# EAGLE design guante_izquierdo (EAGLE 8.0.1)
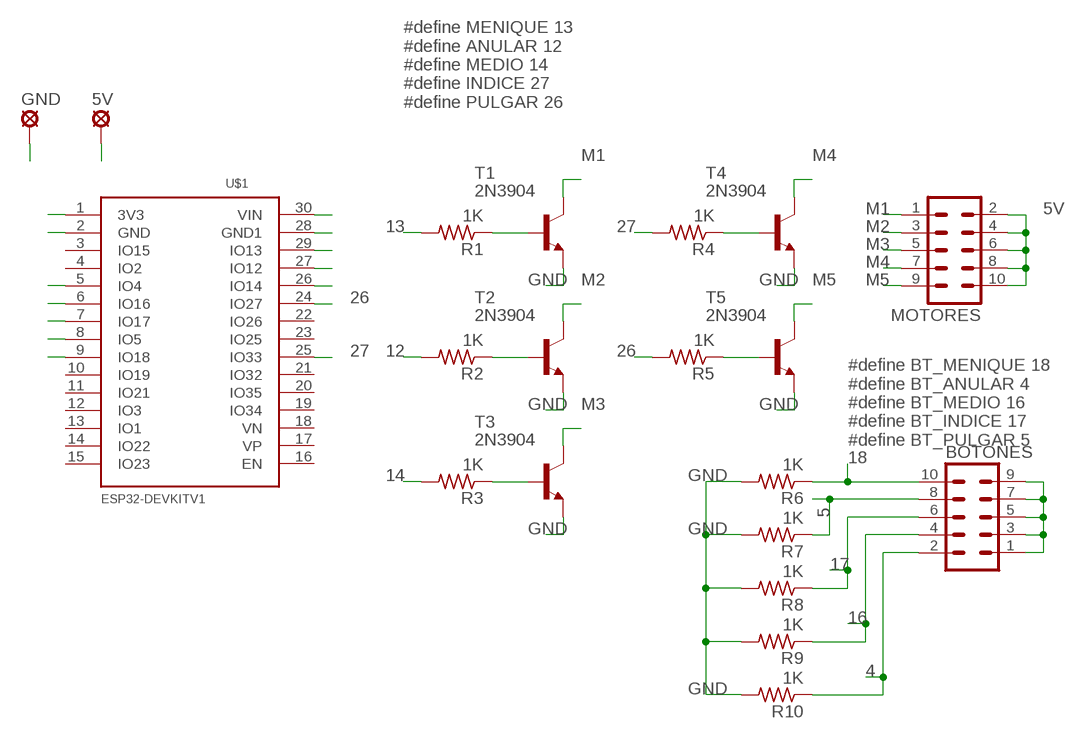
[diagram p0: schematic, sheet 1]

## Parts
5V  MCS10B  [MCS10B]
BOTONES  MA05-2  [MA05-2]
GND  MCS10B  [MCS10B]
MOTORES  MA05-2  [MA05-2]
R1  1K  R-US_0207/10  [0207/10]
R2  1K  R-US_0207/10  [0207/10]
R3  1K  R-US_0207/10  [0207/10]
R4  1K  R-US_0207/10  [0207/10]
R5  1K  R-US_0207/10  [0207/10]
R6  1K  R-US_0207/10  [0207/10]
R7  1K  R-US_0207/10  [0207/10]
R8  1K  R-US_0207/10  [0207/10]
R9  1K  R-US_0207/10  [0207/10]
R10  1K  R-US_0207/10  [0207/10]
T1  2N3904  -NPN-TO92-EBC  [TO92-EBC]
T2  2N3904  -NPN-TO92-EBC  [TO92-EBC]
T3  2N3904  -NPN-TO92-EBC  [TO92-EBC]
T4  2N3904  -NPN-TO92-EBC  [TO92-EBC]
T5  2N3904  -NPN-TO92-EBC  [TO92-EBC]
U$1  ESP32DEVKITV1  [ESP32-DEVKITV1]

## Nets
3V3: BOTONES.1 BOTONES.3 BOTONES.5 BOTONES.7 BOTONES.9 U$1.1(3V3)
4: BOTONES.2 R10.1 U$1.5(IO4)
5: BOTONES.8 R7.1 U$1.8(IO5)
5V: 5V.MP MOTORES.2 MOTORES.4 MOTORES.6 MOTORES.8 MOTORES.10 U$1.30(VIN)
12: R2.2 U$1.27(IO12)
13: R1.2 U$1.29(IO13)
14: R3.2 U$1.26(IO14)
16: BOTONES.4 R9.1 U$1.6(IO16)
17: BOTONES.6 R8.1 U$1.7(IO17)
18: BOTONES.10 R6.1 U$1.9(IO18)
26: R5.2 U$1.24(IO27)
27: R4.2 U$1.25(IO33)
GND: GND.MP R6.2 R7.2 R8.2 R9.2 R10.2 T1.E T2.E T3.E T4.E T5.E U$1.2(GND) U$1.28(GND1)
M1: MOTORES.1 T1.C
M2: MOTORES.3 T2.C
M3: MOTORES.5 T3.C
M4: MOTORES.7 T4.C
M5: MOTORES.9 T5.C
N$1: R2.1 T2.B
N$2: R1.1 T1.B
N$3: R3.1 T3.B
N$11: R4.1 T4.B
N$13: R5.1 T5.B
Unconnected: U$1.3(IO15) U$1.4(IO2) U$1.10(IO19) U$1.11(IO21) U$1.12(IO3) U$1.13(IO1) U$1.14(IO22) U$1.15(IO23) U$1.16(EN) U$1.17(VP) U$1.18(VN) U$1.19(IO34) U$1.20(IO35) U$1.21(IO32) U$1.22(IO26) U$1.23(IO25)

## Notes on the sheet
- #define MENIQUE 13
  #define ANULAR 12
  #define MEDIO 14
  #define INDICE 27
  #define PULGAR 26
- #define BT_MENIQUE 18
  #define BT_ANULAR 4
  #define BT_MEDIO 16
  #define BT_INDICE 17
  #define BT_PULGAR 5

## Library data of the parts
5V GND = solpad:MCS10B: SOLDER PAD MC S1, distributor Buerklin, 15F505
BOTONES MOTORES = con-lstb:MA05-2: PIN HEADER; OC_FARNELL: unknown; OC_NEWARK: unknown
R1-R10 = rcl:R-US_: RESISTOR, American symbol
T1-T5 = transistor:*-NPN-: NPN Transistror BF959 corrected 2008.03.06
U$1 = ESP32-DEVKITV1:ESP32DEVKITV1

## Board
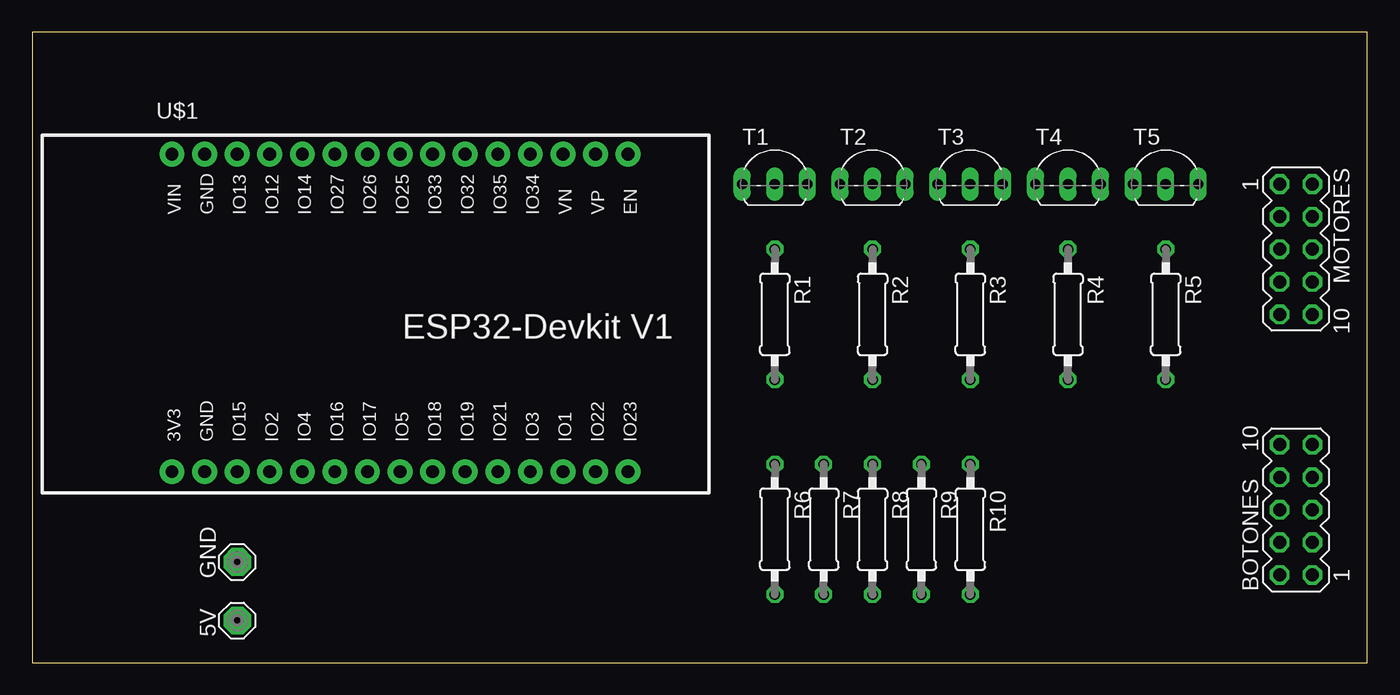
[diagram p1: board, top side]
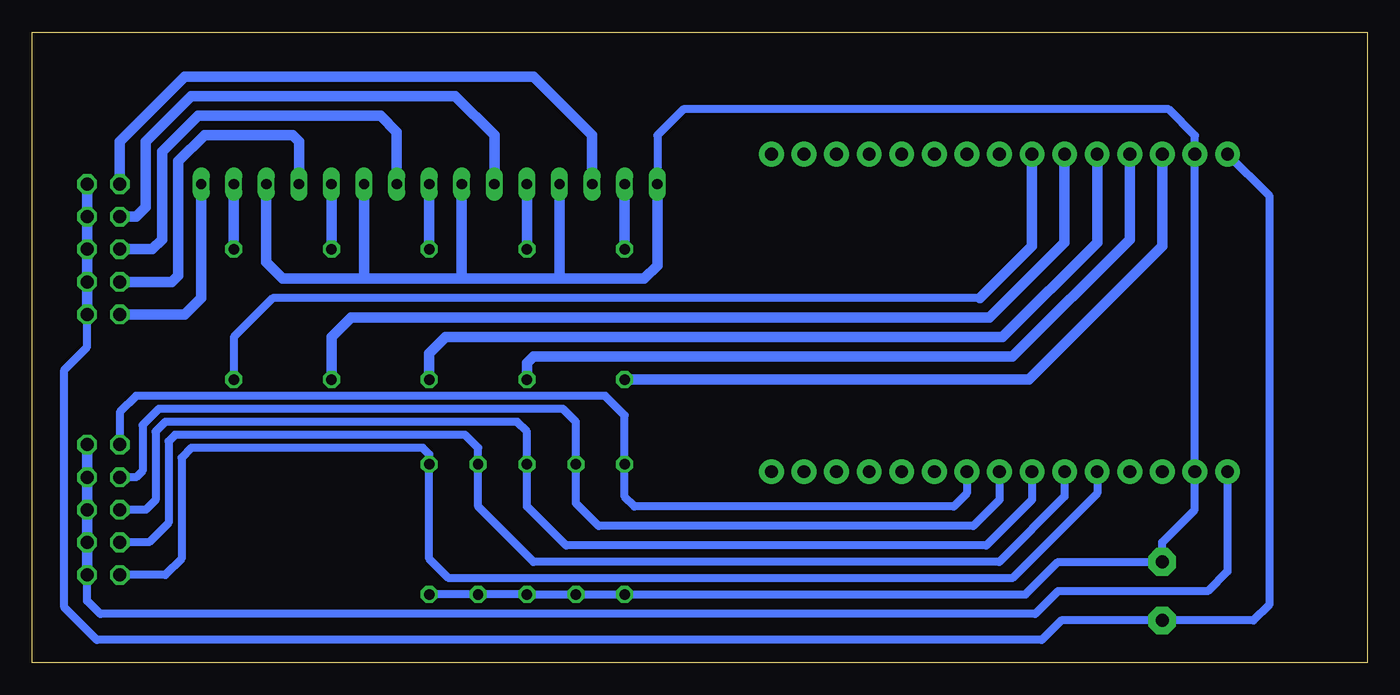
[diagram p2: board, bottom side, seen from below]

Size 104.12 x 49.2 mm. Coordinates in mm from the lower left corner, seen from the top.
Outline: 0,0 104.12,0 104.12,49.2 0,49.2 0,0
Copper layers (1*16): Top 0.035mm / dielectric 1.5mm / Bottom 0.035mm
Design rules "default": minimum track width 10mil, minimum drill 24mil, track to track 8mil, track to pad 8mil, pad to pad 8mil, via to via 8mil, smd to smd 8mil, copper to edge 40mil, drill to drill 8mil, minimum pad ring 10mil, minimum via ring 8mil, stop-mask expansion 4mil, vias tented up to drill 0mil, thermal gap 10mil

### Footprints (pad centres in the part's own frame; a part is rotated, then mirrored left to right if it is on the bottom)
MCS10B = drill 1.016 pad 2.159 octagon: MP 0,0
MA05-2 = drill 1.016 octagon: 1 -5.08,-1.27; 2 -5.08,1.27; 3 -2.54,-1.27; 4 -2.54,1.27; 5 0,-1.27; 6 0,1.27; 7 2.54,-1.27; 8 2.54,1.27; 9 5.08,-1.27; 10 5.08,1.27
0207/10 = drill 0.813 octagon: 1 -5.08,0; 2 5.08,0
TO92-EBC = drill 0.813 long: B 0,-1.27; C 2.54,-1.27; E -2.54,-1.27
ESP32-DEVKITV1 = drill 1 pad 1.93: 1 -22.87,-13.54; 2 -20.33,-13.54; 3 -17.79,-13.54; 4 -15.25,-13.54; 5 -12.71,-13.54; 6 -10.17,-13.54; 7 -7.63,-13.54; 8 -5.09,-13.54; 9 -2.55,-13.54; 10 -0.01,-13.54; 11 2.53,-13.54; 12 5.07,-13.54; 13 7.61,-13.54; 14 10.15,-13.54; 15 12.69,-13.54; 16 12.69,11.23; 17 10.15,11.23; 18 7.61,11.23; 19 5.07,11.23; 20 2.53,11.23; 21 -0.01,11.23; 22 -2.55,11.23; 23 -5.09,11.23; 24 -7.63,11.23; 25 -10.17,11.23; 26 -12.71,11.23; 27 -15.25,11.23; 28 -20.33,11.23; 29 -17.79,11.23; 30 -22.87,11.23

### Placement (x,y rotation side)
5V  16,3.3 90 top
BOTONES  98.55,11.94 90 top
GND  16,7.87 90 top
MOTORES  98.55,32.26 270 top
R1  57.91,27.18 270 top
R2  65.53,27.18 270 top
R3  73.15,27.18 270 top
R4  80.77,27.18 270 top
R5  88.39,27.18 270 top
R6  57.91,10.41 270 top
R7  61.72,10.41 270 top
R8  65.53,10.41 270 top
R9  69.34,10.41 270 top
R10  73.15,10.41 270 top
T1  57.91,38.61 0 top
T2  65.53,38.61 0 top
T3  73.15,38.61 0 top
T4  80.77,38.61 0 top
T5  88.39,38.61 0 top
U$1  33.78,28.45 0 top

### Tracks (layer width: path | path; a pad name or v marks a point on that pad's centre or on a via)
3V3
  Bottom 0.61: U$1.1 10.91,7.12 12.45,5.59 24.13,5.59 25.91,3.81 98.81,3.81 99.82,4.83 BOTONES.1
  Bottom 0.813: BOTONES.1 BOTONES.3 BOTONES.5 BOTONES.7 BOTONES.9
4
  Bottom 0.61: BOTONES.2 93.73,6.86 92.46,8.13 92.46,16 91.69,16.76 73.66,16.76 73.15,16.26 R10.1 73.15,8.13 71.63,6.6 27.69,6.6 21.07,13.22 U$1.5
5
  Bottom 0.61: BOTONES.8 96.01,14.48 95.5,14.99 95.5,18.54 94.23,19.81 62.74,19.81 61.72,18.8 R7.1 61.72,12.45 59.94,10.67 30.73,10.67 28.69,12.71 U$1.8
5V
  Bottom 0.61: U$1.30 7.62,36.39 7.62,4.57 8.89,3.3 5V.MP 23.88,3.3 25.4,1.78 99.06,1.78 101.6,4.32 101.6,22.86 99.82,24.64 MOTORES.10
  Bottom 0.813: MOTORES.10 MOTORES.8 MOTORES.6 MOTORES.4 MOTORES.2
12
  Bottom 0.813: U$1.27 18.53,33.03 27.69,23.88 65.02,23.88 65.53,23.37 R2.2
13
  Bottom 0.813: R1.2 26.42,22.1 16,32.51 16,39.67 U$1.29
14
  Bottom 0.813: U$1.26 21.07,32.78 28.45,25.4 71.88,25.4 73.15,24.13 R3.2
16
  Bottom 0.61: BOTONES.4 95,9.4 93.47,10.92 93.47,17.27 92.96,17.78 70.36,17.78 69.34,16.76 R9.1 69.34,12.19 65.02,7.87 28.7,7.87 23.61,12.96 U$1.6
17
  Bottom 0.61: BOTONES.6 95.25,11.94 94.49,12.7 94.49,18.03 93.73,18.8 66.29,18.8 65.53,18.03 R8.1 65.53,12.19 62.48,9.14 29.72,9.14 26.15,12.71 U$1.7
18
  Bottom 0.61: BOTONES.10 97.28,19.56 96.01,20.83 59.44,20.83 57.91,19.3 R6.1 57.91,12.95 57.15,12.19 32.26,12.19 31.23,13.22 U$1.9
26
  Bottom 0.61: 30.23,28.45 85.34,28.45 88.39,25.4 R5.2
  Bottom 0.813: U$1.24 26.15,32.52 30.23,28.45
27
  Bottom 0.813: U$1.25 23.61,32.78 29.46,26.92 79.25,26.92 80.77,25.4 R4.2
GND
  Bottom 0.61: R10.2 R9.2 R8.2 R7.2 R6.2 26.67,5.33 24.13,7.87 GND.MP 16,9.4 13.46,11.94 13.46,14.9 U$1.2 U$1.28 13.45,41.14 15.49,43.18 53.34,43.18 55.37,41.15 T1.E
  Bottom 0.813: T1.E 55.37,30.99 56.39,29.97 63.25,29.97 | 70.61,29.97 63.25,29.97 | 78.23,29.97 70.61,29.97 | 78.23,29.97 84.58,29.97 85.85,31.24 T5.E | T2.E 62.99,30.23 63.25,29.97 | T3.E 70.61,29.97 | T4.E 78.23,29.97
M1
  Bottom 0.813: MOTORES.1 97.28,40.64 92.2,45.72 65.02,45.72 60.45,41.15 T1.C
M2
  Bottom 0.813: MOTORES.3 96.01,34.8 95.25,35.56 95.25,40.64 91.69,44.2 71.12,44.2 68.07,41.15 T2.C
M3
  Bottom 0.813: MOTORES.5 94.74,32.26 93.98,33.02 93.98,39.88 91.19,42.67 76.96,42.67 75.69,41.4 T3.C
M4
  Bottom 0.813: MOTORES.7 93.22,29.72 92.71,30.23 92.71,39.12 90.68,41.15 83.82,41.15 83.31,40.64 T4.C
M5
  Bottom 0.813: MOTORES.9 92.2,27.18 90.93,28.45 T5.C
N$1
  Bottom 0.813: R2.1 T2.B
N$2
  Bottom 0.813: R1.1 T1.B
N$3
  Bottom 0.813: R3.1 T3.B
N$11
  Bottom 0.813: R4.1 T4.B
N$13
  Bottom 0.813: R5.1 T5.B